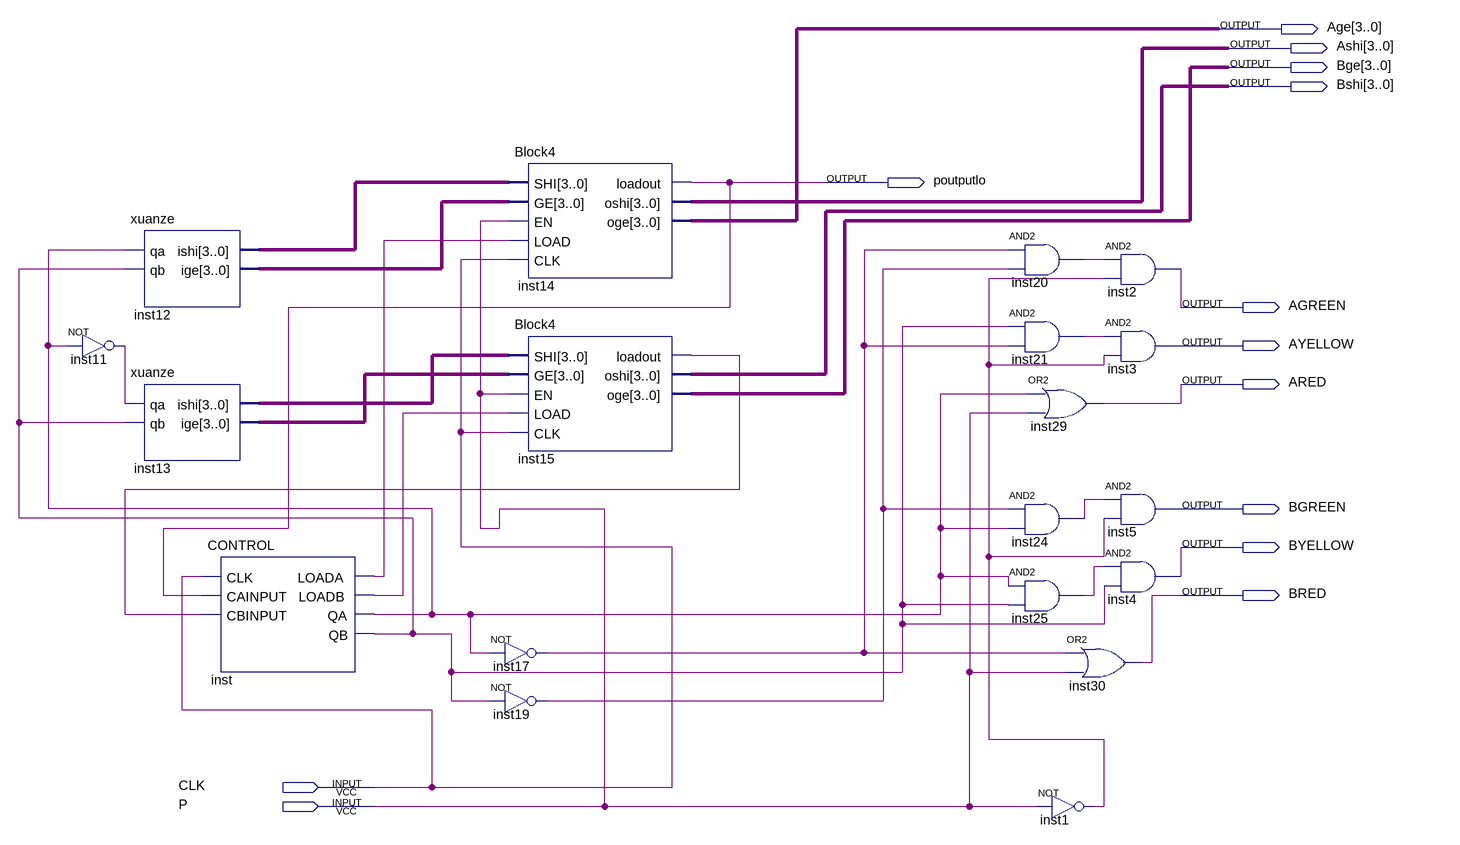
[diagram p0: schematic sheet]
// Quartus schematic light.bdf as structural Verilog: 19 symbols, 13 pins
module light (
  input  CLK,
  input  P,
  output [3:0] Age,
  output [3:0] Ashi,
  output [3:0] Bge,
  output [3:0] Bshi,
  output poutputlo,
  output AGREEN,
  output AYELLOW,
  output ARED,
  output BGREEN,
  output BYELLOW,
  output BRED
);

  wire inst1_out, inst11_out, inst15_loadout, inst17_out, inst19_out, inst20_out, inst21_out, inst24_out,
       inst25_out, inst_loada, inst_loadb, inst_qa, inst_qb;
  wire [3:0] inst12_ige, inst12_ishi, inst13_ige, inst13_ishi;

  xuanze inst12 (.qa(inst_qa), .qb(inst_qb), .ishi(inst12_ishi), .ige(inst12_ige));
  not inst11 (inst11_out, inst_qa);
  xuanze inst13 (.qa(inst11_out), .qb(inst_qb), .ishi(inst13_ishi), .ige(inst13_ige));
  CONTROL inst (
    .CLK(CLK), .CAINPUT(poutputlo), .CBINPUT(inst15_loadout), .LOADA(inst_loada), .LOADB(inst_loadb),
    .QA(inst_qa), .QB(inst_qb));
  Block4 inst14 (
    .SHI(inst12_ishi), .GE(inst12_ige), .EN(P), .LOAD(inst_loada), .CLK(CLK), .loadout(poutputlo),
    .oshi(Ashi), .oge(Age));
  Block4 inst15 (
    .SHI(inst13_ishi), .GE(inst13_ige), .EN(P), .LOAD(inst_loadb), .CLK(CLK), .loadout(inst15_loadout),
    .oshi(Bshi), .oge(Bge));
  not inst17 (inst17_out, inst_qa);
  not inst19 (inst19_out, inst_qb);
  and inst20 (inst20_out, inst17_out, inst19_out);
  and inst21 (inst21_out, inst_qb, inst17_out);
  or inst29 (ARED, inst_qa, P);
  and inst24 (inst24_out, inst19_out, inst_qa);
  and inst25 (inst25_out, inst_qa, inst_qb);
  not inst1 (inst1_out, P);
  and inst2 (AGREEN, inst20_out, inst1_out);
  and inst3 (AYELLOW, inst21_out, inst1_out);
  and inst5 (BGREEN, inst24_out, inst1_out);
  and inst4 (BYELLOW, inst25_out, inst_qb);
  or inst30 (BRED, inst17_out, P);
endmodule
